# EAGLE design Dual VCLFO MAIN (EAGLE 7.7.0)
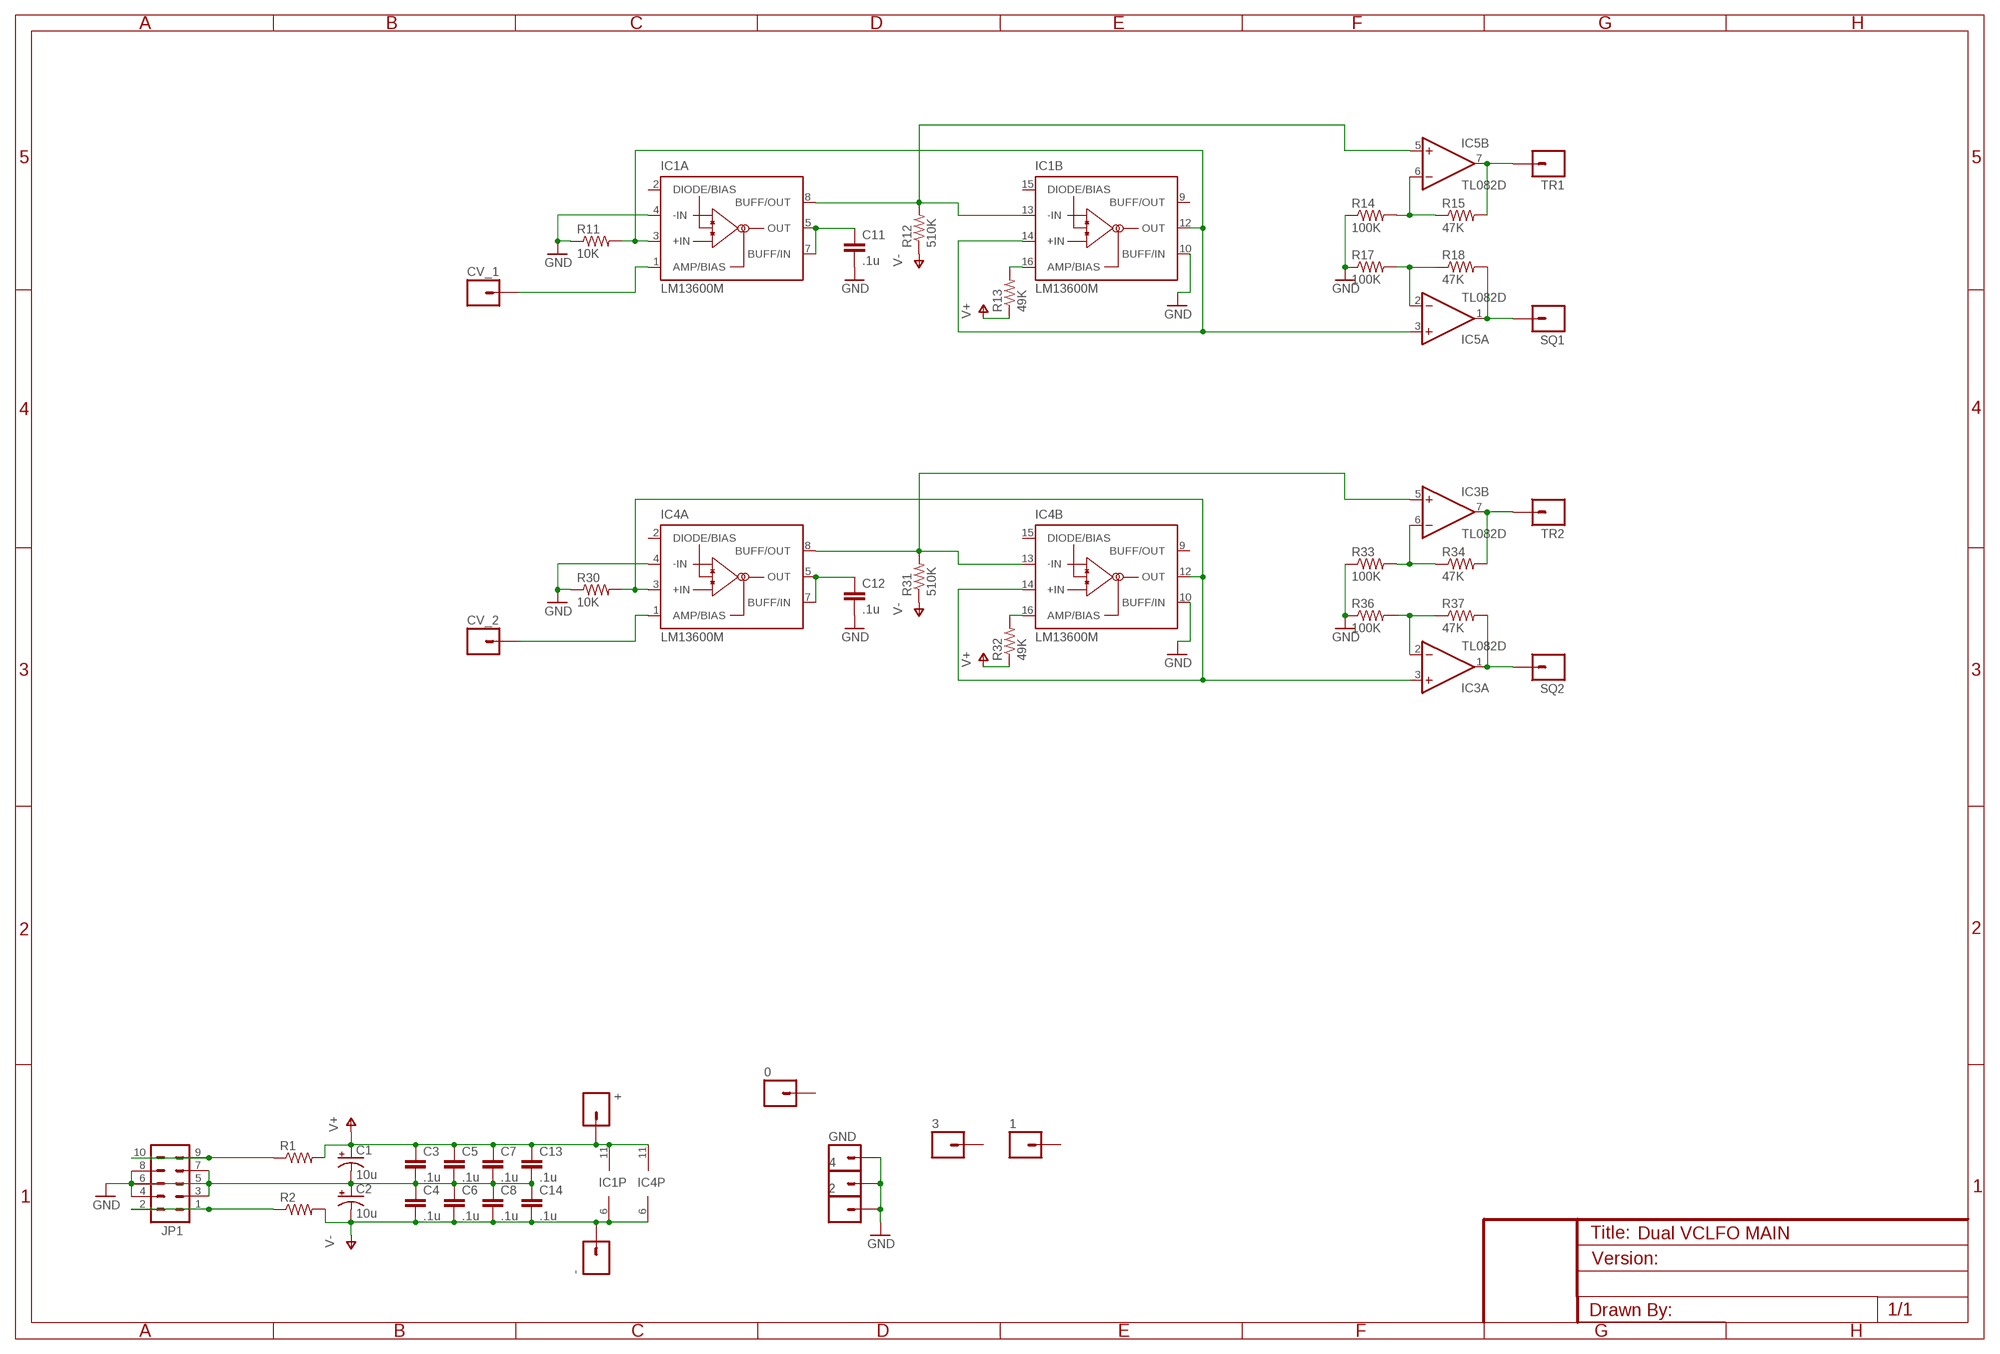
[diagram p0: schematic, sheet 1]

## Parts
0  M01PTH  [1X01]
1  M01PTH  [1X01]
2  M01PTH  [1X01]
3  M01PTH  [1X01]
4  M01PTH  [1X01]
+  M01PTH  [1X01]
-  M01PTH  [1X01]
C1  10u  CAP_POLPTH2  [CPOL-RADIAL-10UF-25V]
C2  10u  CAP_POLPTH2  [CPOL-RADIAL-10UF-25V]
C3  .1u  CAP0805  [0805]
C4  .1u  CAP0805  [0805]
C5  .1u  CAP0805  [0805]
C6  .1u  CAP0805  [0805]
C7  .1u  CAP0805  [0805]
C8  .1u  CAP0805  [0805]
C11  .1u  CAPPTH1  [CAP-PTH-5MM]
C12  .1u  CAPPTH1  [CAP-PTH-5MM]
C13  .1u  CAP0805  [0805]
C14  .1u  CAP0805  [0805]
CV_1  M01PTH  [1X01]
CV_2  M01PTH  [1X01]
GND  M01PTH  [1X01]
IC1  LM13600M  [SO16]
IC3  TL082D  [SO08]
IC4  LM13600M  [SO16]
IC5  TL082D  [SO08]
JP1  M05X2PTH  [AVR_ICSP]
R1  RESISTOR0805-RES  [0805]
R2  RESISTOR0805-RES  [0805]
R11  10K  RESISTOR0805-RES  [0805]
R12  510K  RESISTOR0805-RES  [0805]
R13  49K  RESISTOR0805-RES  [0805]
R14  100K  RESISTOR0805-RES  [0805]
R15  47K  RESISTOR0805-RES  [0805]
R17  100K  RESISTOR0805-RES  [0805]
R18  47K  RESISTOR0805-RES  [0805]
R30  10K  RESISTOR0805-RES  [0805]
R31  510K  RESISTOR0805-RES  [0805]
R32  49K  RESISTOR0805-RES  [0805]
R33  100K  RESISTOR0805-RES  [0805]
R34  47K  RESISTOR0805-RES  [0805]
R36  100K  RESISTOR0805-RES  [0805]
R37  47K  RESISTOR0805-RES  [0805]
SQ1  M01PTH  [1X01]
SQ2  M01PTH  [1X01]
TR1  M01PTH  [1X01]
TR2  M01PTH  [1X01]

## Nets
GND: 2.1 4.1 C1.2(-) C2.1(+) C3.2 C4.1 C5.2 C6.1 C7.2 C8.1 C11.2 C12.2 C13.2 C14.1 GND.1 IC1.4(A:-IN) IC1.10(B:BUFF/IN) IC4.4(A:-IN) IC4.10(B:BUFF/IN) JP1.3 JP1.4 JP1.5 JP1.6 JP1.7 JP1.8 R11.1 R14.1 R17.1 R30.1 R33.1 R36.1
N$5: JP1.9 JP1.10 R1.1
N$6: JP1.1 JP1.2 R2.1
N$9: IC5.2(A:-IN) R17.2 R18.1
N$17: IC3.1(A:OUT) R37.2 SQ2.1
N$19: C11.1 IC1.5(A:OUT) IC1.7(A:BUFF/IN)
N$20: IC1.8(A:BUFF/OUT) IC1.13(B:-IN) IC5.5(B:+IN) R12.2
N$21: IC1.3(A:+IN) IC1.12(B:OUT) IC1.14(B:+IN) IC5.3(A:+IN) R11.2
N$22: IC1.16(B:AMP/BIAS) R13.2
N$23: CV_1.1 IC1.1(A:AMP/BIAS)
N$24: IC5.1(A:OUT) R18.2 SQ1.1
N$25: IC5.6(B:-IN) R14.2 R15.1
N$26: IC5.7(B:OUT) R15.2 TR1.1
N$40: C12.1 IC4.5(A:OUT) IC4.7(A:BUFF/IN)
N$41: IC3.5(B:+IN) IC4.8(A:BUFF/OUT) IC4.13(B:-IN) R31.2
N$42: IC3.3(A:+IN) IC4.3(A:+IN) IC4.12(B:OUT) IC4.14(B:+IN) R30.2
N$43: IC4.16(B:AMP/BIAS) R32.2
N$44: CV_2.1 IC4.1(A:AMP/BIAS)
N$45: IC3.2(A:-IN) R36.2 R37.1
N$47: IC3.6(B:-IN) R33.2 R34.1
N$48: IC3.7(B:OUT) R34.2 TR2.1
V+: +.1 C1.1(+) C3.1 C5.1 C7.1 C13.1 IC1.11(P:V+) IC4.11(P:V+) R1.2 R13.1 R32.1
V-: -.1 C2.2(-) C4.2 C6.2 C8.2 C14.2 IC1.6(P:V-) IC4.6(P:V-) R2.2 R12.1 R31.1
Unconnected: 0.1 1.1 3.1 IC1.2(A:DIODE/BIAS) IC1.9(B:BUFF/OUT) IC1.15(B:DIODE/BIAS) IC4.2(A:DIODE/BIAS) IC4.9(B:BUFF/OUT) IC4.15(B:DIODE/BIAS)

## Power pins joined to a net without a drawn wire
V+: IC3.8(P:V+) IC5.8(P:V+)
V-: IC3.4(P:V-) IC5.4(P:V-)

## Library data of the parts
0 1-4 + - CV_1 CV_2 GND SQ1 SQ2 TR1 TR2 = SparkFun-Connectors:M01: Header 1 Standard 1-pin 0.1" header. Use with straight break away headers (SKU : PRT-00116), right angle break away headers (PRT-00553), swiss pins (PRT-00743), machine pins (PRT-00117), and female headers (PRT-00115).
C1 C2 = SparkFun-Capacitors:CAP_POL: Capacitor Polarized These are standard SMD and PTH capacitors. Normally 10uF, 47uF, and 100uF in electrolytic and tantalum varieties. Always verify the external diameter of the through hole cap, it varies with capacity, voltage, and manufacturer. The EIA devices should be standard.
C3-C8 C11-C14 = SparkFun-Capacitors:CAP: Capacitor Standard 0603 ceramic capacitor, and 0.1" leaded capacitor.
IC1 IC4 = national-semiconductor:LM13600: Dual Operational Transconductance Amplifiers with Linearizing Diodes and Buffers Source: lm13600.PDF
IC3 IC5 = linear:TL082: OP AMP Data sheet <http://www.ti.com/lit/ds/symlink/tl084a . pdf>; DATA_SHEET: <a href="http://www.ti.com/lit/ds/symlink/tl084a.pdf"> Data sheet </a>
JP1 = SparkFun-Connectors:M05X2: Header 5x2 Standard 10-pin dual row 0.1" header. Commonly used with AVR-ISP. Use with Spark Fun Electronics SKU: PRT-00778
R1 R2 R11-R15 R17 R18 R30-R34 R36 R37 = SparkFun-Passives:RESISTOR: Resistor Basic schematic elements and footprints for 0603, 1206, and PTH resistors.

## Board
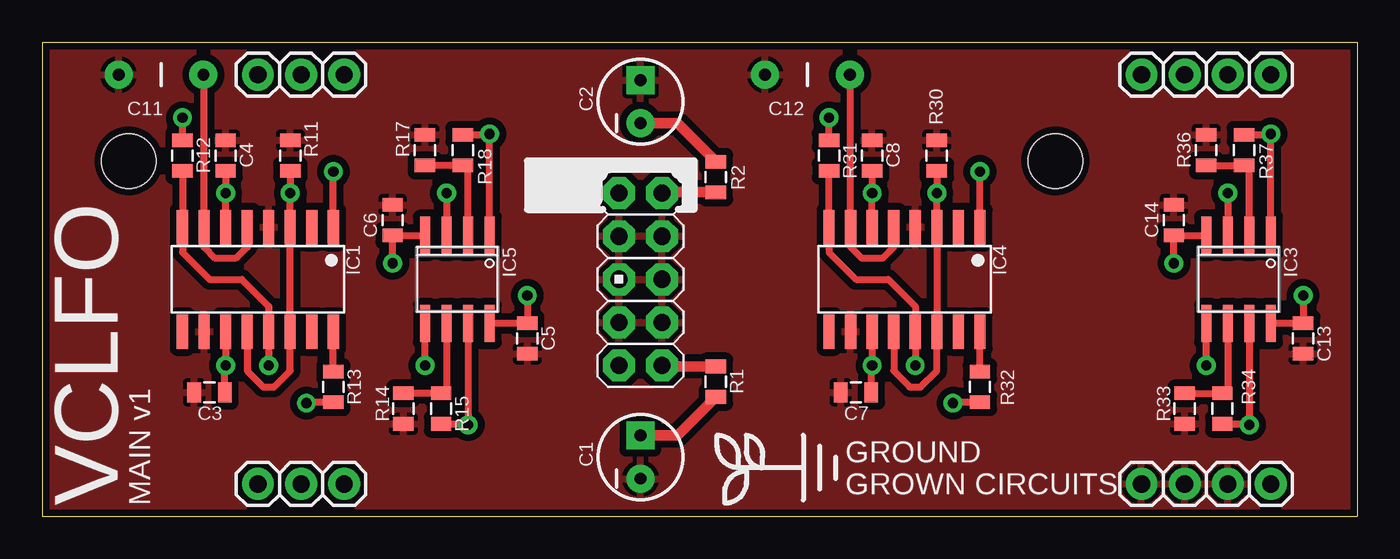
[diagram p1: board, top side]
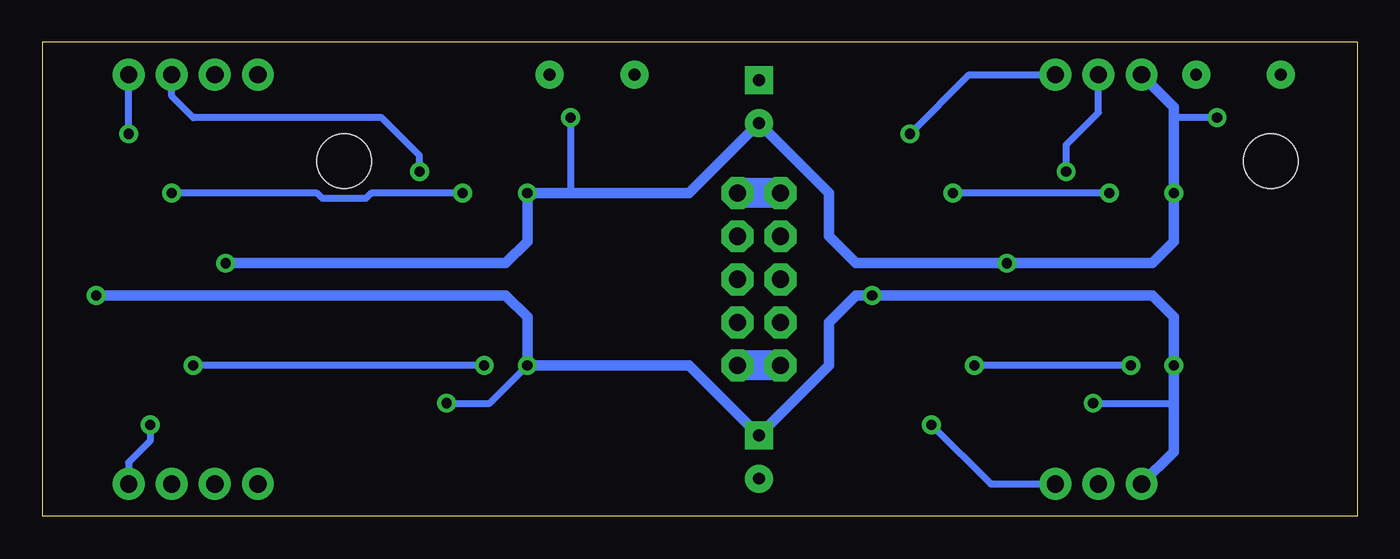
[diagram p2: board, bottom side, seen from below]

Size 77.47 x 27.94 mm. Coordinates in mm from the lower left corner, seen from the top.
Outline: 0,0 77.47,0 77.47,27.94 0,27.94 0,0
Copper layers (1*16): Top 0.035mm / dielectric 1.5mm / Bottom 0.035mm
Design rules "SparkFun": minimum track width 8mil, minimum drill 20mil, track to track 8mil, track to pad 8mil, pad to pad 8mil, via to via 8mil, smd to smd 8mil, copper to edge 8mil, drill to drill 8mil, minimum pad ring 12mil, minimum via ring 10mil, stop-mask expansion 4mil, vias tented up to drill 20mil, thermal gap 10mil
Holes 3.2 mm at 5.08,20.95 59.69,20.95

### Footprints (pad centres in the part's own frame; a part is rotated, then mirrored left to right if it is on the bottom)
1X01 = drill 1.016 pad 1.88: 1 0,0
CPOL-RADIAL-10UF-25V = drill 0.7 pad 1.651 square: 1 1.27,0 | drill 0.7 pad 1.651: 2 -1.27,0
0805 = smd 0.8 x 1.2: 1 -0.9,0; 2 0.9,0
CAP-PTH-5MM = drill 0.7 pad 1.651: 1 -2.5,0; 2 2.5,0
SO16 = smd 0.66 x 2.032: 1 -4.445,-3.073; 2 -3.175,-3.073; 3 -1.905,-3.073; 4 -0.635,-3.073; 5 0.635,-3.073; 6 1.905,-3.073; 7 3.175,-3.073; 8 4.445,-3.073; 9 4.445,3.073; 10 3.175,3.073; 11 1.905,3.073; 12 0.635,3.073; 13 -0.635,3.073; 14 -1.905,3.073; 15 -3.175,3.073; 16 -4.445,3.073
SO08 = smd 0.6 x 2.2: 1 -1.905,-2.6; 2 -0.635,-2.6; 3 0.635,-2.6; 4 1.905,-2.6; 5 1.905,2.6; 6 0.635,2.6; 7 -0.635,2.6; 8 -1.905,2.6
AVR_ICSP = drill 1.016 pad 1.88 octagon: 1 -1.27,5.08; 2 1.27,5.08; 3 -1.27,2.54; 4 1.27,2.54; 5 -1.27,0; 6 1.27,0; 7 -1.27,-2.54; 8 1.27,-2.54; 9 -1.27,-5.08; 10 1.27,-5.08

### Placement (x,y rotation side)
0  15.24,1.91 0 top
1  64.77,26.04 0 top
2  64.77,1.91 0 top
3  67.31,26.04 180 top
4  67.31,1.91 0 top
+  12.7,1.91 0 top
-  12.7,26.04 180 top
C1  35.24,3.49 90 top
C2  35.24,24.45 90 top
C3  9.84,7.3 180 top
C4  10.79,21.27 270 top
C5  28.57,10.48 270 top
C6  20.64,17.46 270 top
C7  47.94,7.3 180 top
C8  48.9,21.27 270 top
C11  6.99,26.04 180 top
C12  45.09,26.04 180 top
C13  74.3,10.48 270 top
C14  66.67,17.46 270 top
CV_1  15.24,26.04 270 top
CV_2  69.85,26.04 270 top
GND  69.85,1.91 90 top
IC1  12.7,13.97 180 top
IC3  70.48,13.97 180 top
IC4  50.8,13.97 180 top
IC5  24.45,13.97 180 top
JP1  35.24,13.97 0 top
R1  39.69,7.94 270 top
R2  39.69,20 90 top
R11  14.61,21.27 270 top
R12  8.26,21.27 270 top
R13  17.14,7.62 90 top
R14  21.27,6.35 90 top
R15  23.5,6.35 270 top
R17  22.54,21.59 270 top
R18  24.77,21.59 90 top
R30  52.7,21.27 270 top
R31  46.35,21.27 270 top
R32  55.24,7.62 90 top
R33  67.31,6.35 90 top
R34  69.53,6.35 270 top
R36  68.58,21.59 270 top
R37  70.8,21.59 90 top
SQ1  17.78,26.04 270 top
SQ2  72.39,26.04 270 top
TR1  17.78,1.91 90 top
TR2  72.39,1.91 90 top
U$1  [LOGO_SMALL]  44.77,2.86 90 top

### Tracks (layer width: path | path; a pad name or v marks a point on that pad's centre or on a via)
GND
  pour Top (isolate 0.406): 0,0 77.47,0 77.47,27.94 0,27.94
N$5
  Top 0.61: R1.1 36.56,8.84 JP1.10
  Bottom 1.778: JP1.9 JP1.10
N$6
  Top 0.61: R2.1 36.56,19.1 JP1.2
  Bottom 1.778: JP1.1 JP1.2
N$9
  Top 0.406: IC5.2 25.08,20.37 R18.1 R17.2
N$17  (via drill 0.6)
  Top 0.406: IC3.1 v72.39,22.54 72.34,22.49 R37.2
  Bottom 0.406: v72.39,22.54 SQ2.1
N$19
  Top 0.406: IC1.5 12.06,15.88 11.43,15.24 10.16,15.24 9.53,15.88 IC1.7 9.53,26 C11.1
N$20  (via drill 0.6)
  Top 0.406: v13.34,8.89 IC1.13 13.34,12.38 11.75,13.97 9.84,13.97 8.26,15.56 IC1.8 R12.2 | v22.54,8.89 IC5.5
  Bottom 0.406: v13.34,8.89 v22.54,8.89
N$21  (via drill 0.6)
  Top 0.406: v23.81,19.05 IC5.3 | R11.2 v14.61,19.05 IC1.3 IC1.14 14.61,8.57 13.65,7.62 13.02,7.62 12.06,8.57 IC1.12
  Bottom 0.406: v14.61,19.05 v23.81,19.05
N$22
  Top 0.406: R13.2 IC1.16
N$23  (via drill 0.6)
  Top 0.406: IC1.1 v17.14,20.32
  Bottom 0.406: v17.14,20.32 17.14,21.91 15.24,23.81 CV_1.1
N$24  (via drill 0.6)
  Top 0.406: IC5.1 v26.35,22.54 26.3,22.49 R18.2
  Bottom 0.406: v26.35,22.54 22.86,26.04 SQ1.1
N$25
  Top 0.406: IC5.6 23.81,7.57 R15.1 R14.2
N$26  (via drill 0.6)
  Top 0.406: IC5.7 v25.08,5.4 25.03,5.45 R15.2
  Bottom 0.406: v25.08,5.4 21.59,1.91 TR1.1
N$40
  Top 0.406: C12.1 47.62,26 IC4.7 47.62,15.88 48.26,15.24 49.53,15.24 50.16,15.88 IC4.5
N$41  (via drill 0.6)
  Top 0.406: R31.2 IC4.8 46.35,15.56 47.94,13.97 49.85,13.97 51.44,12.38 IC4.13 v51.44,8.89 | v68.58,8.89 IC3.5
  Bottom 0.406: v51.44,8.89 v68.58,8.89
N$42  (via drill 0.6)
  Top 0.406: v69.85,19.05 IC3.3 | R30.2 v52.7,19.05 IC4.3 IC4.14 52.7,8.57 51.75,7.62 51.12,7.62 50.16,8.57 IC4.12
  Bottom 0.406: v52.7,19.05 58.1,19.05 58.42,18.73 60.96,18.73 61.28,19.05 v69.85,19.05
N$43
  Top 0.406: R32.2 IC4.16
N$44  (via drill 0.6)
  Top 0.406: IC4.1 v55.24,20.32
  Bottom 0.406: v55.24,20.32 55.24,21.27 57.47,23.5 68.58,23.5 69.85,24.77 CV_2.1
N$45
  Top 0.406: R36.2 R37.1 71.12,20.37 IC3.2
N$47
  Top 0.406: R33.2 R34.1 69.85,7.57 IC3.6
N$48  (via drill 0.6)
  Top 0.406: IC3.7 v71.12,5.4 71.07,5.45 R34.2
  Bottom 0.406: v71.12,5.4 71.12,4.45 72.39,3.17 TR2.1
V+  (via drill 0.6)
  Top 0.406: IC1.11 v10.79,8.89 10.74,8.84 C3.1 | v28.57,13.02 C5.1 IC5.8 | IC4.11 v48.9,8.89 48.84,8.84 C7.1 | v74.3,13.02 C13.1 IC3.8 | R13.1 15.61,6.72 v15.56,6.67 | R32.1 53.71,6.72 v53.66,6.67
  Top 0.61: C1.1 37.41,4.76 R1.2
  Bottom 0.406: v15.56,6.67 10.79,6.67 | v53.66,6.67 51.12,6.67 v48.9,8.89
  Bottom 0.61: +.1 10.79,3.81 10.79,6.67 v10.79,8.89 10.79,11.75 12.06,13.02 v28.57,13.02 29.53,13.02 31.11,11.43 31.11,8.89 C1.1 39.37,8.89 v48.9,8.89 48.9,11.75 50.16,13.02 v74.3,13.02
V-  (via drill 0.6)
  Top 0.406: IC1.6 v10.79,19.05 C4.2 | v20.64,14.92 C6.2 IC5.4 | IC4.6 v48.9,19.05 C8.2 | v66.67,14.92 C14.2 IC3.4 | R12.1 v8.26,23.5 | R31.1 v46.35,23.5
  Top 0.61: C2.2 37.41,23.18 R2.2
  Bottom 0.406: v8.26,23.5 10.79,23.5 | v46.35,23.5 46.35,19.05
  Bottom 0.61: -.1 10.79,24.13 10.79,23.5 v10.79,19.05 10.79,16.19 12.06,14.92 v20.64,14.92 29.53,14.92 31.11,16.51 31.11,19.05 C2.2 39.37,19.05 46.35,19.05 v48.9,19.05 48.9,16.19 50.16,14.92 v66.67,14.92

### Text on the board
tPlace: VCLFO | MAIN v1 | GROUND / GROWN CIRCUITS